# EAGLE design My_Project (EAGLE 7.7.0)
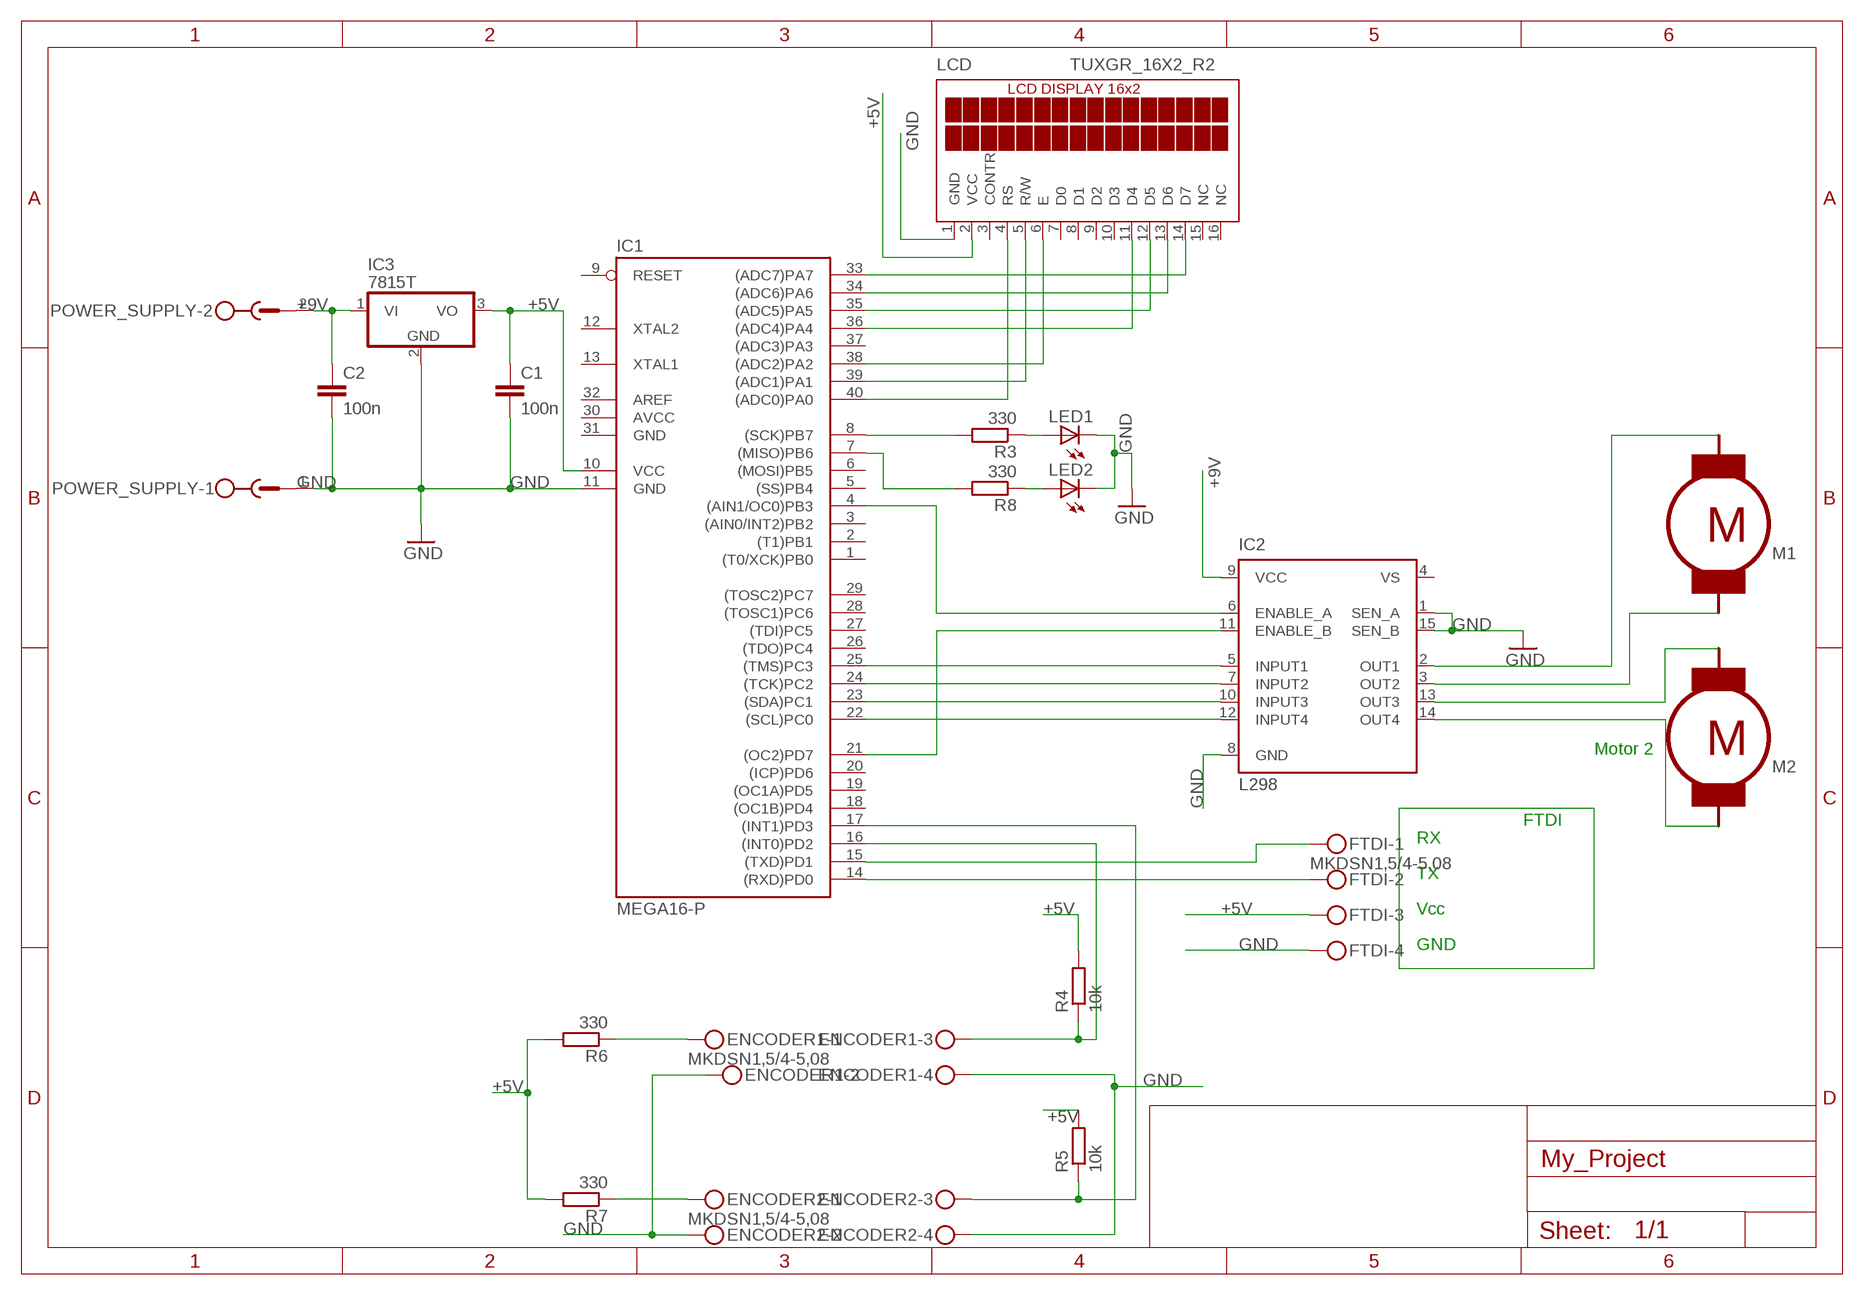
[diagram p0: schematic, sheet 1]

## Parts
C1  100n  C2,5-3  [C2.5-3]
C2  100n  C2,5-3  [C2.5-3]
ENCODER1  MKDSN1,5/4-5,08  [MKDSN1,5/4-5,08]
ENCODER2  MKDSN1,5/4-5,08  [MKDSN1,5/4-5,08]
FTDI  MKDSN1,5/4-5,08  [MKDSN1,5/4-5,08]
IC1  MEGA16-P  [DIL40]
IC2  L298  [MULTIWATT-15]
IC3  7815T  [TO220H]
LCD  TUXGR_16X2_R2  [TUXGR_16X2_R2]
LED1  LEDLZR181  [LZR181]
LED2  LEDLZR181  [LZR181]
M1  MOTOR_DC_EINFACH_XL  [2PIN]
M2  MOTOR_DC_EINFACH_XL  [2PIN]
POWER_SUPPLY  MSTBV2  [MSTBV2]
R3  330  R-EU_0207/10  [0207/10]
R4  10k  R-EU_0207/10  [0207/10]
R5  10k  R-EU_0207/10  [0207/10]
R6  330  R-EU_0207/10  [0207/10]
R7  330  R-EU_0207/10  [0207/10]
R8  330  R-EU_0207/10  [0207/10]

## Nets
+5V: C1.1 FTDI.3 IC1.10(VCC) IC3.3(VO) LCD.2(VCC) R4.2 R5.2 R6.2 R7.2
+9V: C2.1 IC2.9(VCC) IC3.1(VI) POWER_SUPPLY.2
GND: C1.2 C2.2 ENCODER1.2 ENCODER1.4 ENCODER2.2 ENCODER2.4 FTDI.4 IC1.11(GND) IC2.1(SEN_A) IC2.8(GND) IC2.15(SEN_B) IC3.2(GND) LCD.1(GND) LED1.K(C) LED2.K(C) POWER_SUPPLY.1
N$1: IC1.33((ADC7)PA7) LCD.14(D7)
N$2: IC1.34((ADC6)PA6) LCD.13(D6)
N$3: IC1.35((ADC5)PA5) LCD.12(D5)
N$4: IC1.36((ADC4)PA4) LCD.11(D4)
N$5: IC1.38((ADC2)PA2) LCD.6(E)
N$6: IC1.39((ADC1)PA1) LCD.5(R/W)
N$7: IC1.40((ADC0)PA0) LCD.4(RS)
N$8: IC1.4((AIN1/OC0)PB3) IC2.6(ENABLE_A)
N$9: IC1.21((OC2)PD7) IC2.11(ENABLE_B)
N$10: IC1.7((MISO)PB6) R8.2
N$12: IC1.25((TMS)PC3) IC2.5(INPUT1)
N$13: IC1.24((TCK)PC2) IC2.7(INPUT2)
N$14: IC1.23((SDA)PC1) IC2.10(INPUT3)
N$15: IC1.22((SCL)PC0) IC2.12(INPUT4)
N$16: IC1.8((SCK)PB7) R3.2
N$18: LED1.A R3.1
N$19: LED2.A R8.1
N$21: IC2.2(OUT1) M1.1(R1)
N$22: IC2.3(OUT2) M1.2(R2)
N$23: IC2.13(OUT3) M2.1(R1)
N$24: IC2.14(OUT4) M2.2(R2)
N$26: ENCODER1.1 R6.1
N$27: ENCODER1.3 IC1.16((INT0)PD2) R4.1
N$28: ENCODER2.3 IC1.17((INT1)PD3) R5.1
N$29: ENCODER2.1 R7.1
RX: FTDI.2 IC1.14((RXD)PD0)
TX: FTDI.1 IC1.15((TXD)PD1)
Unconnected: IC1.1((T0/XCK)PB0) IC1.2((T1)PB1) IC1.3((AIN0/INT2)PB2) IC1.5((SS)PB4) IC1.6((MOSI)PB5) IC1.9(RESET) IC1.12(XTAL2) IC1.13(XTAL1) IC1.18((OC1B)PD4) IC1.19((OC1A)PD5) IC1.20((ICP)PD6) IC1.26((TDO)PC4) IC1.27((TDI)PC5) IC1.28((TOSC1)PC6) IC1.29((TOSC2)PC7) IC1.32(AREF) IC1.37((ADC3)PA3) LCD.3(CONTR) LCD.7(D0) LCD.8(D1) LCD.9(D2) LCD.10(D3) LCD.15(NC) LCD.16(NC)

## Notes on the sheet
- Motor 2
- FTDI
- RX
- TX
- Vcc
- GND

## Power pins joined to a net without a drawn wire
AVCC: IC1.30(AVCC)
GND: IC1.31(GND)
VS: IC2.4(VS)

## Library data of the parts
C1 C2 = capacitor-wima:C: CAPACITOR naming: grid - package width
ENCODER1 ENCODER2 FTDI = con-phoenix-508:MKDSN1,5/4-5,08: MKDSN 1,5/ 4-5,08 Printklemme Nennstrom: 13,5 A Nennspannung: 250 V Rastermaß: 5,08 mm Polzahl: 4 Anschlussart: Schraubanschluss Montage: Löten Anschlussrichtung Leiter/Platine: 0 ° Artikelnummer: 1729144 Source: http://eshop.phoenixcontact.com .. 1729144.pdf
IC1 = atmel:MEGA16-P: MICROCONTROLLER 16 Kbytes FLASH 1 kbytes SRAM 512 bytes EEPROM USART 8-channel 10 bit ADC Source: avr.lbr; MPN: ATMEGA16-16PU; OC_FARNELL: 9171142; OC_NEWARK: 01M6885
IC2 = st-microelectronics:L298: DUAL FULL-BRIDGE DRIVER; MPN: L298N; OC_FARNELL: 1589425; OC_NEWARK: 32M1527
IC3 = linear:78*: Positive VOLTAGE REGULATOR Source: http://cache.national.com/ds/LM/LM78L05.pdf http://www.fairchildsemi.com/ds/LM/LM7805.pdf
LCD = display-lcd:TUXGR_16X2_R2: Tuxgraphics LCD display 16x2 characters reflective, without background light Source: tuxgr_12x2_r2.pdf; OC_FARNELL: unknown; OC_NEWARK: unknown
LED1 LED2 = led:LED: LED OSRAM: - CHIPLED LG R971, LG N971, LY N971, LG Q971, LY Q971, LO R971, LY R971 LH N974, LH R974 LS Q976, LO Q976, LY Q976 LO Q996 - Hyper CHIPLED LW Q18S LB Q993, LB Q99A, LB R99A - SideLED LS A670, LO A670, LY A670, LG A670, LP A670 LB A673, LV A673, LT A673, LW A673 LH A674 LY A675 LS A676, LA A676, LO A676, LY A676, LW A676 LS A679, LY A679, LG A679 - Hyper Micro SIDELED® LS Y876, LA Y876, LO Y876, LY Y876 LT Y87S - SmartLED LW L88C, LW L88S LB L89C, LB L89S, LG L890 LS L89K, LO L89K, LY L89K LS L896, LA L896, LO L896, LY L896 - TOPLED LS T670, LO T670, LY T670, LG T670, LP T670 LSG T670, LSP T670, LSY T670, LOP T670, LYG T670 LG T671, LOG T671, LSG T671 LB T673, LV T673, LT T673, LW T673 LH T674 LS T676, LA T676, LO T676, LY T676, LB T676, LH T676, LSB T676, LW T676 LB T67C, LV T67C, LT T67C, LS T67K, LO T67K, LY T67K, LW E67C LS E67B, LA E67B, LO E67B, LY E67B, LB E67C, LV E67C, LT E67C LW T67C LS T679, LY T679, LG T679 LS T770, LO T770, LY T770, LG T770, LP T770 LB T773, LV T773, LT T773, LW T773 LH T774 LS E675, LA E675, LY E675, LS T675 LS T776, LA T776, LO T776, LY T776, LB T776 LHGB T686 LT T68C, LB T68C - Hyper Mini TOPLED® LB M676 - Mini TOPLED Santana® LG M470 LS M47K, LO M47K, LY M47K Source: http://www.osram.convergy.de LUXEON: - LUMILED® LXK2-PW12-R00, LXK2-PW12-S00, LXK2-PW14-U00, LXK2-PW14-V00 LXK2-PM12-R00, LXK2-PM12-S00, LXK2-PM14-U00 LXK2-PE12-Q00, LXK2-PE12-R00, LXK2-PE12-S00, LXK2-PE14-T00, LXK2-PE14-U00 LXK2-PB12-K00, LXK2-PB12-L00, LXK2-PB12-M00, LXK2-PB14-N00, LXK2-PB14-P00, LXK2-PB14-Q00 LXK2-PR12-L00, LXK2-PR12-M00, LXK2-PR14-Q00, LXK2-PR14-R00 LXK2-PD12-Q00, LXK2-PD12-R00, LXK2-PD12-S00 LXK2-PH12-R00, LXK2-PH12-S00 LXK2-PL12-P00, LXK2-PL12-Q00, LXK2-PL12-R00 Source: www.luxeon.com KINGBRIGHT: KA-3528ASYC Source: www.kingbright.com
M1 M2 = schule_xl:MOTOR_DC_EINFACH_XL
POWER_SUPPLY = con-phoenix-500:MSTBV2: PHOENIX; OC_FARNELL: unknown; OC_NEWARK: unknown
R3-R8 = resistor:R-EU_: RESISTOR, European symbol

## Board
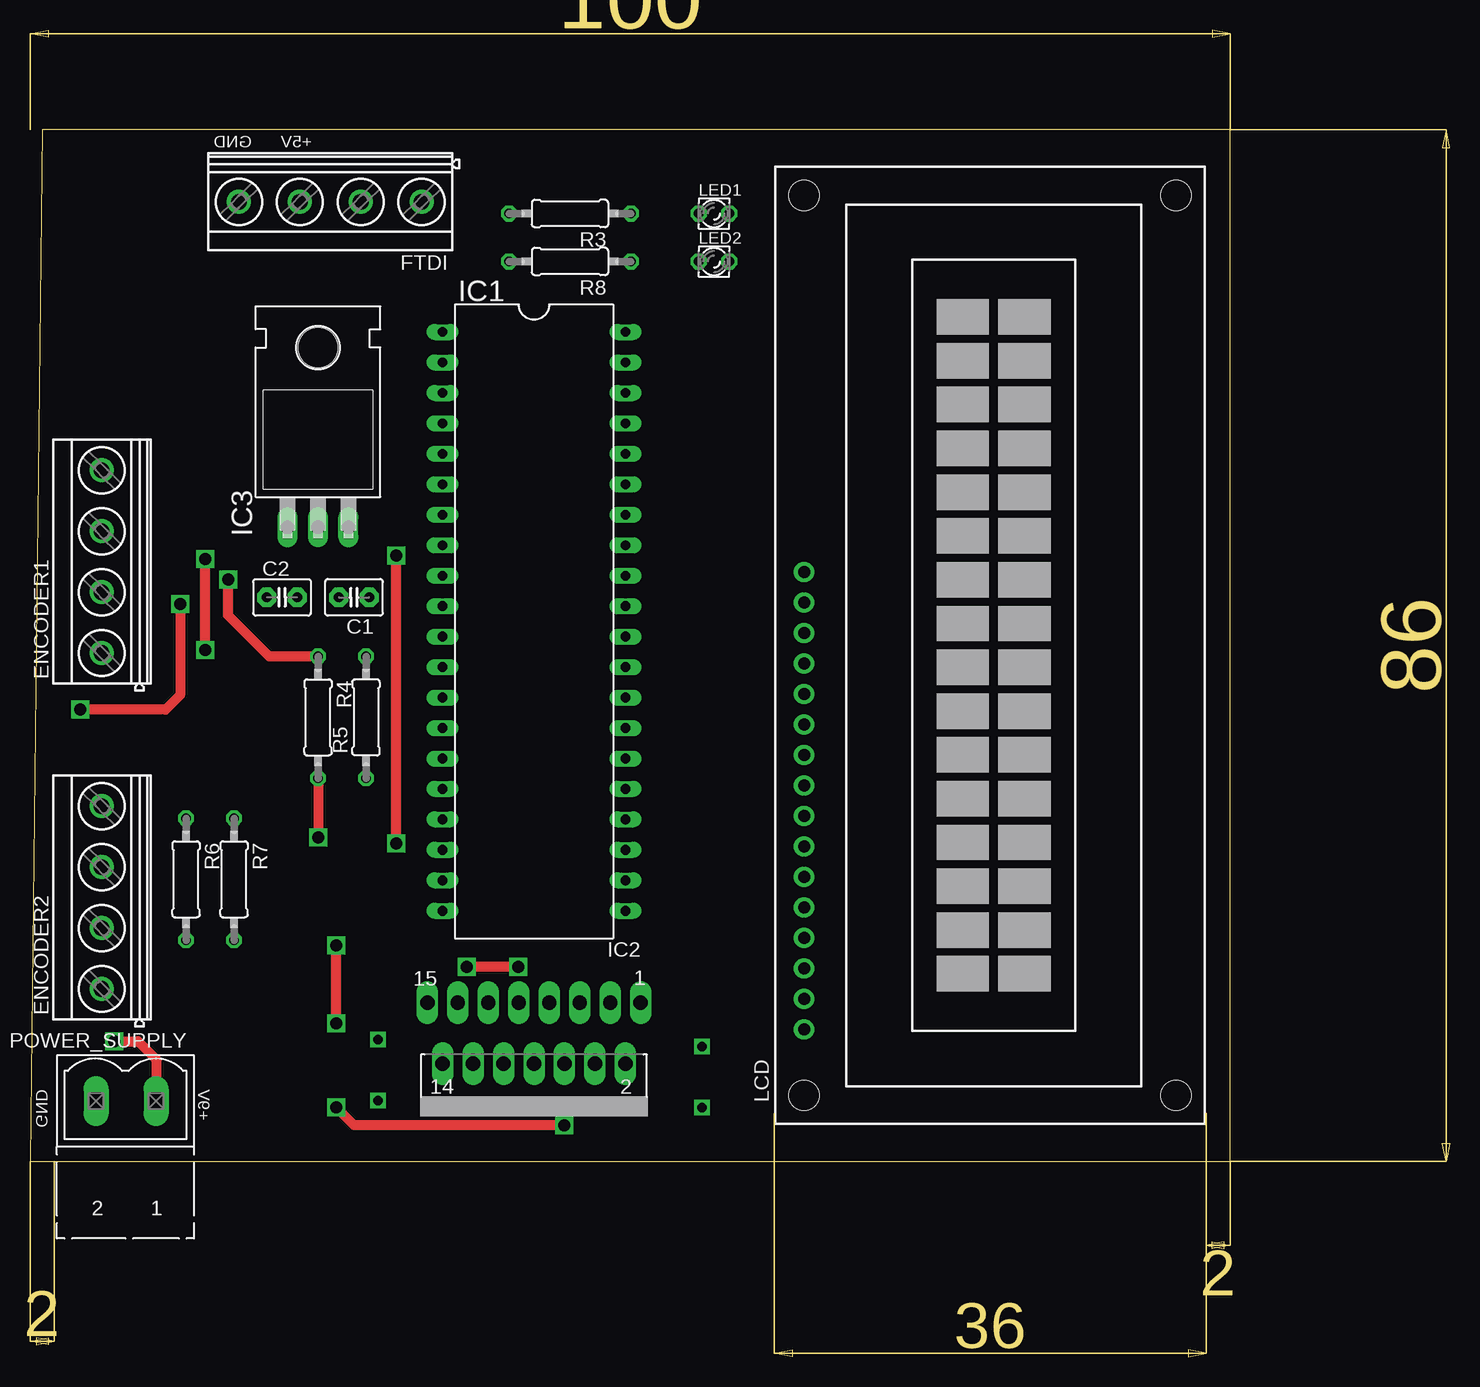
[diagram p1: board, top side]
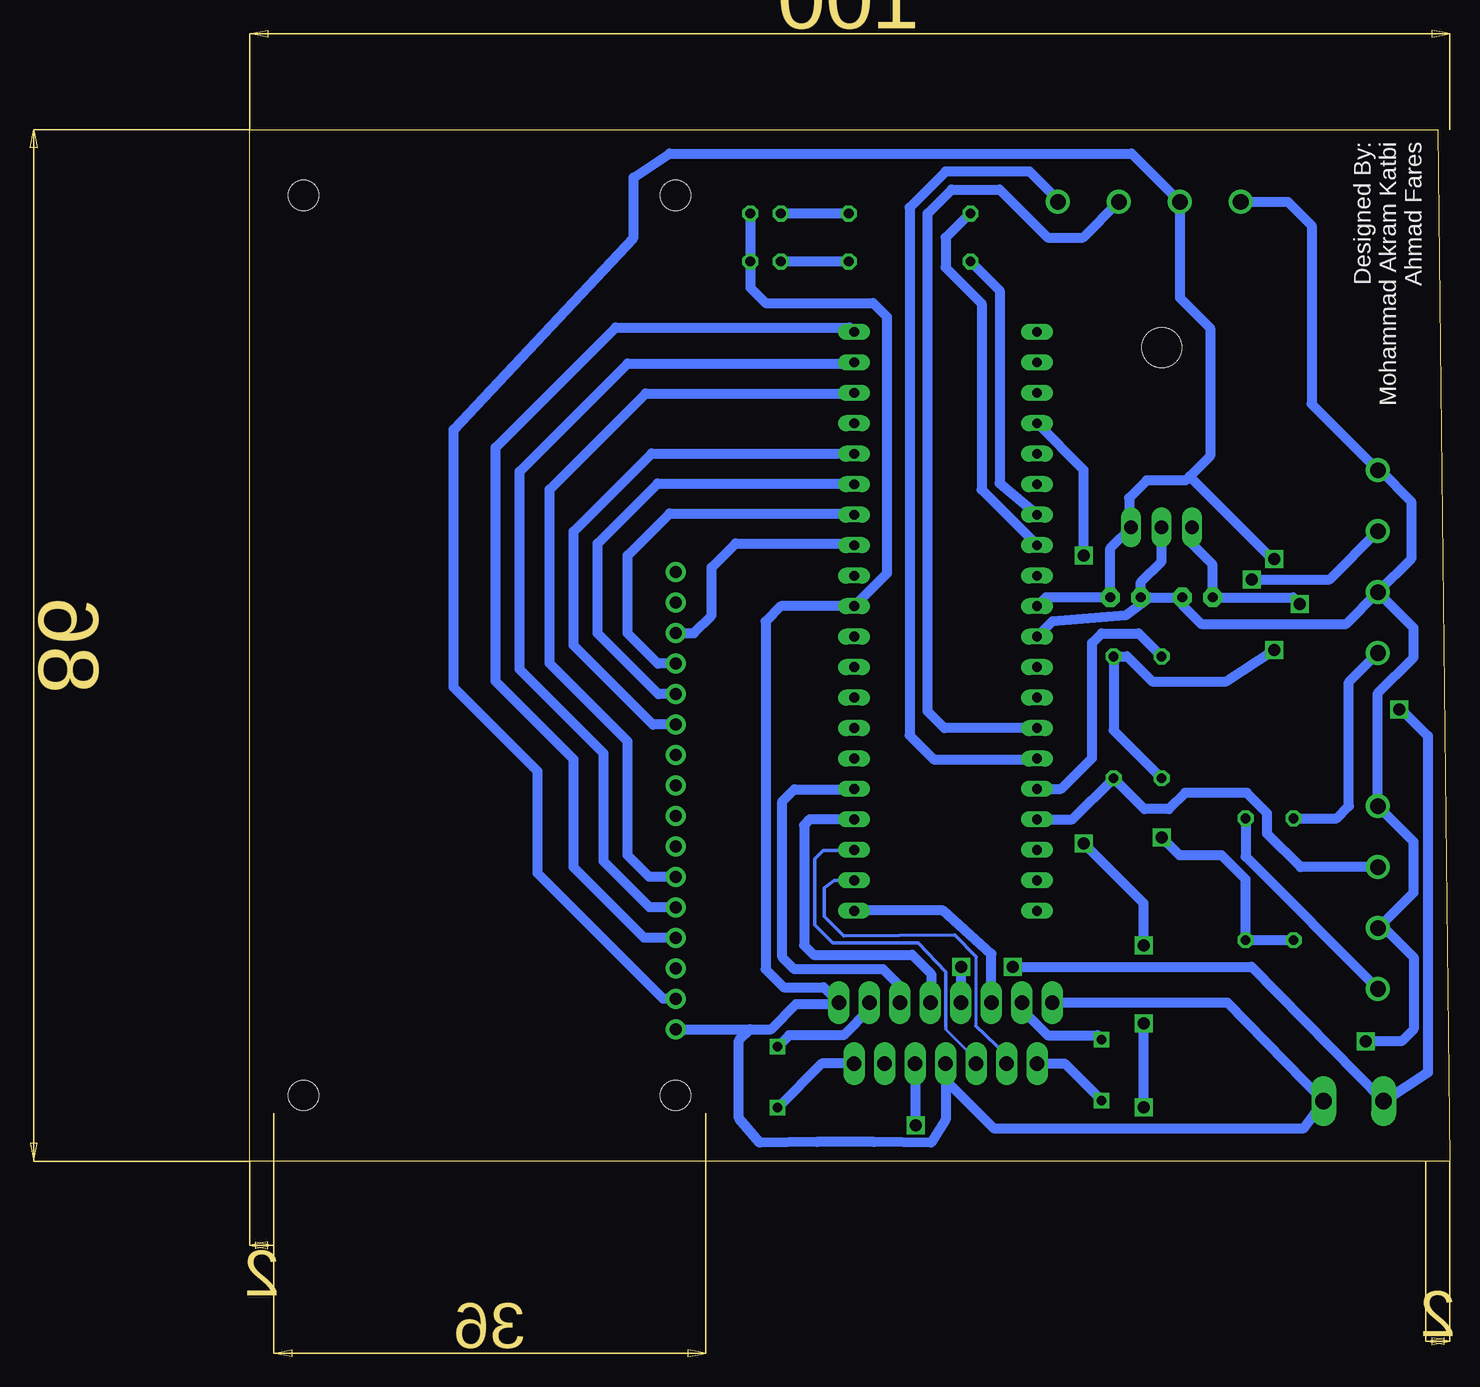
[diagram p2: board, bottom side, seen from below]

Size 100 x 86 mm. Coordinates in mm from the lower left corner, seen from the top.
Outline: 0,0 100,0 100,86 1,86 0,0
Copper layers (1*16): Top 0.035mm / dielectric 1.5mm / Bottom 0.035mm
Design rules "default": minimum track width 10mil, minimum drill 24mil, track to track 8mil, track to pad 8mil, pad to pad 8mil, via to via 8mil, smd to smd 8mil, copper to edge 40mil, drill to drill 8mil, minimum pad ring 10mil, minimum via ring 8mil, stop-mask expansion 4mil, vias tented up to drill 0mil, thermal gap 10mil

### Footprints (pad centres in the part's own frame; a part is rotated, then mirrored left to right if it is on the bottom)
C2.5-3 = drill 0.813 pad 1.6 octagon: 1 -1.27,0; 2 1.27,0
MKDSN1,5/4-5,08 = drill 1.3 pad 2: 1 -7.641,0.025; 2 -2.561,0.025; 3 2.519,0.025; 4 7.599,0.025
DIL40 = drill 0.813 long: 1 -24.13,-7.62; 2 -21.59,-7.62; 3 -19.05,-7.62; 4 -16.51,-7.62; 5 -13.97,-7.62; 6 -11.43,-7.62; 7 -8.89,-7.62; 8 -6.35,-7.62; 9 -3.81,-7.62; 10 -1.27,-7.62; 11 1.27,-7.62; 12 3.81,-7.62; 13 6.35,-7.62; 14 8.89,-7.62; 15 11.43,-7.62; 16 13.97,-7.62; 17 16.51,-7.62; 18 19.05,-7.62; 19 21.59,-7.62; 20 24.13,-7.62; 21 24.13,7.62; 22 21.59,7.62; 23 19.05,7.62; 24 16.51,7.62; 25 13.97,7.62; 26 11.43,7.62; 27 8.89,7.62; 28 6.35,7.62; 29 3.81,7.62; 30 1.27,7.62; 31 -1.27,7.62; 32 -3.81,7.62; 33 -6.35,7.62; 34 -8.89,7.62; 35 -11.43,7.62; 36 -13.97,7.62; 37 -16.51,7.62; 38 -19.05,7.62; 39 -21.59,7.62; 40 -24.13,7.62
MULTIWATT-15 = drill 1.2 long: 1 -8.89,-7.62; 2 -7.62,-2.54; 3 -6.35,-7.62; 4 -5.08,-2.54; 5 -3.81,-7.62; 6 -2.54,-2.54; 7 -1.27,-7.62; 8 0,-2.54; 9 1.27,-7.62; 10 2.54,-2.54; 11 3.81,-7.62; 12 5.08,-2.54; 13 6.35,-7.62; 14 7.62,-2.54; 15 8.89,-7.62
TO220H = drill 1.118 long: 1 -2.54,-10.16; 2 0,-10.16; 3 2.54,-10.16 | hole 3.302: 0,4.826
TUXGR_16X2_R2 = drill 1 pad 1.676: 1 -32,15.5; 2 -29.46,15.5; 3 -26.92,15.5; 4 -24.38,15.5; 5 -21.84,15.5; 6 -19.3,15.5; 7 -16.76,15.5; 8 -14.22,15.5; 9 -11.68,15.5; 10 -9.14,15.5; 11 -6.6,15.5; 12 -4.06,15.5; 13 -1.52,15.5; 14 1.02,15.5; 15 3.56,15.5; 16 6.1,15.5 | hole 2.5: -37.5,-15.5; 37.5,-15.5; -37.5,15.5; 37.5,15.5
LZR181 = drill 0.813 octagon: A -1.27,0; K 1.27,0
2PIN = drill 0.8 square: 1 0,2.54; 2 0,-2.54
MSTBV2 = drill 1.397 long: 1 -2.5,0; 2 2.5,0
0207/10 = drill 0.813 octagon: 1 -5.08,0; 2 5.08,0

### Placement (x,y rotation side)
C1  27,47 180 top
C2  21,47 0 top
ENCODER1  6,50 90 top
ENCODER2  6,22 90 top
FTDI  25,80 180 top
IC1  42,45 270 top
IC2  42,5.6 180 top
IC3  24,63 0 top
LCD  80,43 90 top
LED1  57,79 0 top
LED2  57,75 0 top
M1  56,7 180 top
M2  29,7.6 0 top
POWER_SUPPLY  8,5 180 top
R3  45,79 180 top
R4  24,37 270 top
R5  28,37 90 top
R6  13,23.5 270 top
R7  17,23.5 270 top
R8  45,75 180 top

### Tracks (layer width: path | path; a pad name or v marks a point on that pad's centre or on a via)
+5V  (via drill 1 pad 1.27)
  Top 0.813: R4.2 v24,27 | v14.6,42.6 v14.6,50.2
  Bottom 0.813: R6.2 R7.2 17,23.5 19,25.5 22.5,25.5 v24,27 | 34.51,46.4 IC1.10 33.65,47 C1.1 28.27,51.11 IC3.3 26.7,53 26.7,55.3 25.25,56.75 22,56.75 21.68,57.08 | 21.68,57.08 19.95,58.8 19.95,69.45 22.48,71.98 FTDI.3 26.51,84 65,84 68,82 68,77 83,61 83,39.5 76,32.5 76,24 65.54,13.54 LCD.2 | R4.2 28,35.92 R5.2 26.88,42.08 24.8,40 18.6,40 v14.6,42.6 | v14.6,50.2 15,50.4 21.68,57.08
+9V  (via drill 1 pad 1.27)
  Top 0.813: v40.7,16.2 v36.4,16.2 | v12.5,46.45 12.5,38.85 11.3,37.65 v4.2,37.65
  Bottom 0.813: IC3.1 21.46,51.46 19.8,49.8 19.8,47.07 C2.1 13.05,47 v12.5,46.45 | IC2.9 40.7,13.22 v40.7,16.2 | v36.4,16.2 16.5,16.2 POWER_SUPPLY.2 1.81,7.4 1.81,35.45 4.01,37.65 v4.2,37.65
GND  (via drill 1 pad 1.27)
  Top 0.813: v7,10 9,10 10.5,8.5 POWER_SUPPLY.1
  Bottom 0.813: LED1.K LED2.K 58.27,72.82 57,71.55 48.05,71.55 46.9,70.4 46.9,48.99 IC1.31 55.73,46.27 57,45 57,16 55.5,14.5 52.17,14.5 IC2.1 51.01,13.1 54.45,13.1 56.55,11 58.3,11 | ENCODER1.2 3.2,50.21 3.2,55 5.8,57.6 ENCODER1.4 11.5,63.12 11.5,78 13.47,79.97 FTDI.4 | 25,47 C2.2 22.27,46.37 20.7,44.8 8.61,44.8 ENCODER1.2 | IC3.2 24,50 25.73,48.27 C1.2 25,47 | 25,47 27,45.5 33.11,45 IC1.11 | LCD.1 58.3,11 | IC2.15 18.52,13.22 POWER_SUPPLY.1 12.15,2.75 38,2.75 42,6.75 IC2.8 42,3.45 43.2,1.55 arc-2 57.5,1.55 59.23,3.58 59.23,10.07 58.3,11 | ENCODER1.2 3,44.46 3,42 5.97,39.02 ENCODER2.4 3,26.62 3,22.4 ENCODER2.2 5.44,19.44 3,17 3,11 4,10 v7,10
N$1
  Bottom 0.813: LCD.14 62.98,44.02 61.5,45.5 61.5,49.5 59.5,51.5 49.77,51.5 IC1.33
N$2
  Bottom 0.813: LCD.13 65.98,41.48 68.5,44 68.5,50.5 65,54 49.73,54 IC1.34
N$3
  Bottom 0.813: LCD.12 65.94,38.94 71,44 71,51.5 66,56.5 49.69,56.5 IC1.35
N$4
  Bottom 0.813: LCD.11 66.4,36.4 73,43 73,52.5 66.5,59 49.65,59 IC1.36
N$5
  Bottom 0.813: LCD.6 66.7,23.7 68.5,25.5 68.5,35 75,41.5 75,56 67,64 49.67,64 IC1.38
N$6
  Bottom 0.813: LCD.5 66.66,21.16 70.5,25 70.5,34 77.5,41 77.5,57.5 68.5,66.5 49.71,66.5 IC1.39
N$7
  Bottom 0.813: LCD.4 67.12,18.62 73,24.5 73,33.5 79.5,40 79.5,59.5 69.5,69.5 49.99,69.5 IC1.40
N$8  (via drill 1 pad 1.27)
  Top 0.813: v44.5,3 27,3 v25.5,4.5 | v25.5,11.5 v25.5,18 | v30.5,26.5 v30.5,50.5
  Bottom 0.813: IC2.6 44.54,3.04 v44.5,3 | v25.5,4.5 v25.5,11.5 | v25.5,18 25.5,21.5 v30.5,26.5 | v30.5,50.5 30.5,57.63 IC1.4
N$9
  Bottom 0.813: IC2.11 38.19,17.29 42.2,20.9 49.19,20.9 IC1.21
N$10
  Bottom 0.813: IC1.7 37.5,56.51 37.5,72.58 R8.2
N$12
  Bottom 0.813: IC2.5 45.81,14.61 47.2,16 54.6,16 55.6,17 55.6,30 54.6,31 49.65,31 IC1.25
N$13
  Bottom 0.813: IC1.24 53.31,28.49 53.8,28 53.8,18 53,17.2 44.8,17.2 43.2,15.6 43.2,13.29 IC2.7
N$14
  Bottom 0.254: 42,11.2 42,11 39.5,8.5 39.5,8.18 IC2.10
  Bottom 0.305: 42,11.2 42,15.8 44.3,18.2 51.4,18.2 52.9,19.7 52.9,25.2 52.2,25.9 49.67,25.9 IC1.23
N$15
  Bottom 0.254: 39.48,11.26 39.43,11.26 39.43,17.01
  Bottom 0.305: IC2.12 36.92,8.82 39.48,11.26 | 39.43,17.01 41.25,18.85 50.5,18.8 52.1,20.4 52.1,22.8 51.3,23.4 49.81,23.4 IC1.22
N$16
  Bottom 0.813: R3.2 40,79 42,77 42,74.5 39,71.5 39,55.97 IC1.8
N$18
  Bottom 0.813: R3.1 LED1.A
N$19
  Bottom 0.813: R8.1 LED2.A
N$21
  Bottom 0.813: IC2.2 52.32,8.14 M1.1
N$22
  Bottom 0.813: IC2.3 48.35,12.65 50.5,10.5 55.04,10.5 M1.2
N$23
  Bottom 0.813: IC2.13 35.65,12.65 33.5,10.5 29.36,10.5 M2.1
N$24
  Bottom 0.813: IC2.14 32.08,8.14 M2.2
N$26
  Bottom 0.813: R6.1 9.42,28.58 8.4,29.6 8.4,39.93 ENCODER1.1
N$27  (via drill 1 pad 1.27)
  Top 0.813: R4.1 19.92,42.08 16.5,45.5 v16.5,48.5
  Bottom 0.813: v16.5,48.5 9.99,48.5 ENCODER1.3 | IC1.16 32.37,31.03 29.8,33.6 29.8,43.2 29,44 25.92,44 R4.1
N$28
  Bottom 0.813: IC1.17 31.43,28.49 R5.1 25.43,29.35 23.4,29.35 22.05,30.7 16.9,30.7 15.2,29 15.2,27.3 12.42,24.52 ENCODER2.3
N$29
  Bottom 0.813: R7.1 17,25.38 ENCODER2.1
RX
  Bottom 0.813: IC1.14 42.11,36.11 43.5,37.5 43.5,79 41.5,81 37.5,81 33.5,77 30.54,77 FTDI.2
TX
  Bottom 0.813: FTDI.1 32.64,80.14 35,82.5 42,82.5 45,79.5 45,35.5 43,33.5 34.45,33.5 IC1.15

### Text on the board
tNames: GND | +5V | GND | +9V
bNames: Designed By: / Mohammad Akram Katbi / Ahmad Fares